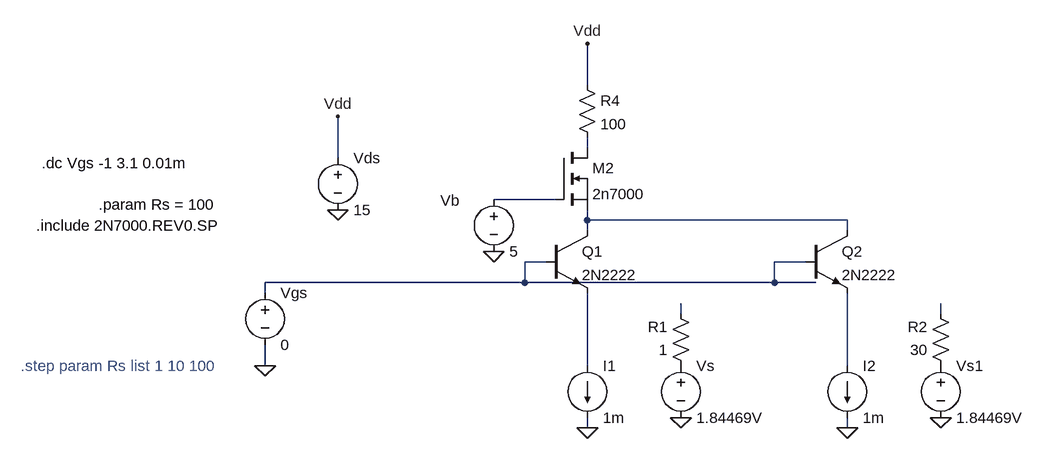
[diagram p0: schematic bjt+cascodo+fte cte.asc]
bjt+cascodo+fte cte.asc, the LTspice schematic file:
Version 4
SHEET 1 928 680
WIRE 208 -96 208 -160
WIRE 208 0 208 -16
WIRE -176 16 -176 -48
WIRE 160 80 64 80
WIRE 208 112 208 96
WIRE 608 112 208 112
WIRE 208 128 208 112
WIRE 608 128 608 112
WIRE 144 176 112 176
WIRE 544 176 496 176
WIRE 112 208 112 176
WIRE 112 208 -288 208
WIRE 496 208 496 176
WIRE 496 208 112 208
WIRE 560 208 496 208
WIRE -288 224 -288 208
WIRE 352 256 352 240
WIRE 752 256 752 240
WIRE -288 336 -288 304
WIRE 208 336 208 224
WIRE 608 336 608 224
WIRE 208 432 208 416
WIRE 608 432 608 416
FLAG -288 336 0
FLAG -176 96 0
FLAG 208 432 0
FLAG -176 -48 Vdd
FLAG 208 -160 Vdd
FLAG 352 416 0
FLAG 64 160 0
FLAG 608 432 0
FLAG 752 416 0
SYMBOL voltage -288 208 R0
WINDOW 123 0 0 Left 2
WINDOW 39 0 0 Left 2
SYMATTR InstName Vgs
SYMATTR Value 0
SYMBOL voltage -176 0 R0
WINDOW 123 0 0 Left 2
WINDOW 39 0 0 Left 2
SYMATTR InstName Vds
SYMATTR Value 15
SYMBOL res 368 352 R180
WINDOW 0 36 76 Left 2
WINDOW 3 36 40 Left 2
SYMATTR InstName R1
SYMATTR Value 1
SYMBOL res 192 -112 R0
SYMATTR InstName R4
SYMATTR Value 100
SYMBOL current 208 336 R0
WINDOW 123 0 0 Left 2
WINDOW 39 0 0 Left 2
SYMATTR InstName I1
SYMATTR Value 1m
SYMBOL voltage 352 320 R0
WINDOW 123 0 0 Left 2
WINDOW 39 0 0 Left 2
SYMATTR InstName Vs
SYMATTR Value 1.84469V
SYMBOL nmos 160 0 R0
SYMATTR InstName M2
SYMATTR Value 2n7000
SYMATTR Prefix X
SYMBOL voltage 64 64 R0
WINDOW 0 -82 18 Left 2
WINDOW 123 0 0 Left 2
WINDOW 39 0 0 Left 2
SYMATTR InstName Vb
SYMATTR Value 5
SYMBOL res 768 352 R180
WINDOW 0 36 76 Left 2
WINDOW 3 36 40 Left 2
SYMATTR InstName R2
SYMATTR Value 30
SYMBOL current 608 336 R0
WINDOW 123 0 0 Left 2
WINDOW 39 0 0 Left 2
SYMATTR InstName I2
SYMATTR Value 1m
SYMBOL voltage 752 320 R0
WINDOW 123 0 0 Left 2
WINDOW 39 0 0 Left 2
SYMATTR InstName Vs1
SYMATTR Value 1.84469V
SYMBOL npn 144 128 R0
SYMATTR InstName Q1
SYMATTR Value 2N2222
SYMBOL npn 544 128 R0
SYMATTR InstName Q2
SYMATTR Value 2N2222
TEXT -632 24 Left 2 !.dc Vgs -1 3.1 0.01m
TEXT -544 88 Left 2 !.param Rs = 100
TEXT -664 336 Left 2 ;.step param Rs list 1 10 100
TEXT -640 120 Left 2 !.include 2N7000.REV0.SP

The netlist it stands for:
* bjt+cascodo+fte cte.asc
Vgs N004 0 0
Vds Vdd 0 15
R1 P001 N005 1
R4 Vdd N001 100
I1 N007 0 1m
Vs P001 0 1.84469V
XM2 N001 N002 N003 2n7000  ; pins D G S
Vb N002 0 5
R2 P002 N006 30
I2 N008 0 1m
Vs1 P002 0 1.84469V
Q1 N003 N004 N007 0 2N2222
Q2 N003 N004 N008 0 2N2222
.model NPN NPN
.model PNP PNP
.lib standard.bjt
.dc Vgs -1 3.1 0.01m
.param Rs = 100
* .step param Rs list 1 10 100
.include 2N7000.REV0.SP
.backanno
.end